# EAGLE design glove (EAGLE 7.6.0)

## Sheet 1 of 4
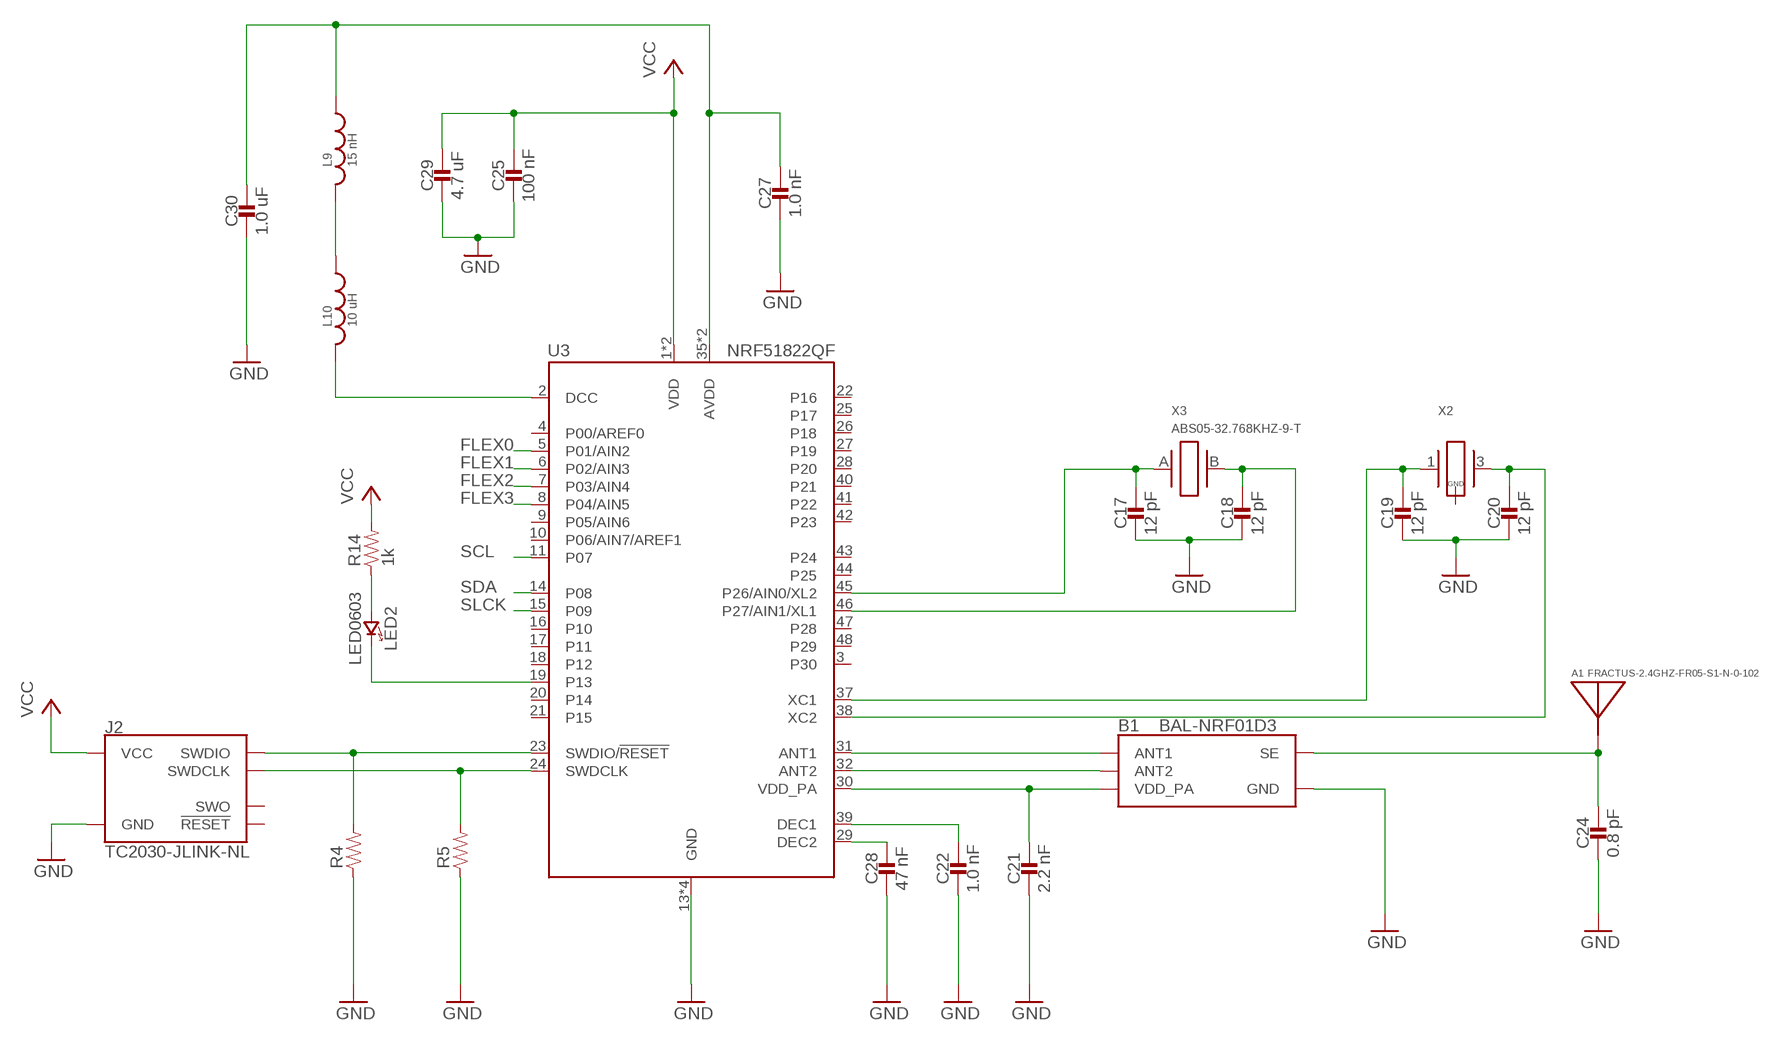
[diagram p0: schematic, sheet 1]

### Parts
A1  FRACTUS-2.4GHZ-FR05-S1-N-0-102  [FRACTUS-ANTENNA-FR05-S1-N-0-102]
B1  BAL-NRF01D3  [BAL-NRF01D3]
C17  12 pF  CAPACITOR0402_CAP  [0402_CAP]
C18  12 pF  CAPACITOR0402_CAP  [0402_CAP]
C19  12 pF  CAPACITOR0402_CAP  [0402_CAP]
C20  12 pF  CAPACITOR0402_CAP  [0402_CAP]
C21  2.2 nF  CAPACITOR0402_CAP  [0402_CAP]
C22  1.0 nF  CAPACITOR0402_CAP  [0402_CAP]
C24  0.8 pF  CAPACITOR0402_CAP  [0402_CAP]
C25  100 nF  CAPACITOR0402_CAP  [0402_CAP]
C27  1.0 nF  CAPACITOR0402_CAP  [0402_CAP]
C28  47 nF  CAPACITOR0402_CAP  [0402_CAP]
C29  4.7 uF  CAPACITOR0603_CAP  [0603_CAP]
C30  1.0 uF  CAPACITOR0603_CAP  [0603_CAP]
J2  TC2030-JLINK-NL  [TC2030-IDC-NL]
L9  15 nH  INDUCTOR0402  [0402_CAP]
L10  10 uH  INDUCTOR0603  [0603_CAP]
LED2  LED0603  [LED-0603]
R4  RESISTOR0603_RES  [0603-RES]
R5  RESISTOR0603_RES  [0603-RES]
R14  1k  RESISTOR0603_RES  [0603-RES]
U3  NRF51822QF  [QFN-48-6MM]
X2  TXC-8Y  [TXC-8Y]
X3  ABS05-32.768KHZ-9-T  [ABS05]

### Nets
FLEX0: U3.5(P01/AIN2)
FLEX1: U3.6(P02/AIN3)
FLEX2: U3.7(P03/AIN4)
FLEX3: U3.8(P04/AIN5)
GND: B1.GND C17.2 C18.2 C19.2 C20.2 C21.2 C22.2 C24.2 C25.2 C27.2 C28.2 C29.2 C30.2 J2.5(GND) R4.1 R5.1 U3.13(GND) U3.33(GND) U3.34(GND) U3.GND ; also sheet 2,3,4
N$6: LED2.C(CATHODE) U3.19(P13)
N$8: LED2.A(ANODE) R14.1
N$14: L10.2 U3.2(DCC)
N$15: L9.2 L10.1
N$16: C27.1 C30.1 L9.1 U3.35(AVDD) U3.36(AVDD)
N$19: J2.2(SWDIO) R4.2 U3.23(SWDIO/!RESET)
N$20: C20.1 U3.38(XC2) X2.3
N$21: B1.ANT1 U3.31(ANT1)
N$22: B1.ANT2 U3.32(ANT2)
N$23: B1.VCC(VDD_PA) C21.1 U3.30(VDD_PA)
N$24: A1.1(ANTENNA) B1.SE C24.1
N$25: C28.1 U3.29(DEC2)
N$26: C22.1 U3.39(DEC1)
N$27: C17.1 U3.45(P26/AIN0/XL2) X3.A
N$28: C18.1 U3.46(P27/AIN1/XL1) X3.B
N$29: C19.1 U3.37(XC1) X2.1
N$30: J2.4(SWDCLK) R5.2 U3.24(SWDCLK)
SCL: U3.11(P07) ; also sheet 2,3
SDA: U3.14(P08) ; also sheet 2,3
SLCK: U3.15(P09)
VCC: C25.1 C29.1 J2.1(VCC) R14.2 U3.1(VDD) U3.12(VDD) ; also sheet 3,4
Unconnected: J2.3(!RESET) J2.6(SWO) U3.3(P30) U3.4(P00/AREF0) U3.9(P05/AIN6) U3.10(P06/AIN7/AREF1) U3.16(P10) U3.17(P11) U3.18(P12) U3.20(P14) U3.21(P15) U3.22(P16) U3.25(P17) U3.26(P18) U3.27(P19) U3.28(P20) U3.40(P21) U3.41(P22) U3.42(P23) U3.43(P24) U3.44(P25) U3.47(P28) U3.48(P29) X2.2(GND) X2.4(GND)

## Sheet 2 of 4
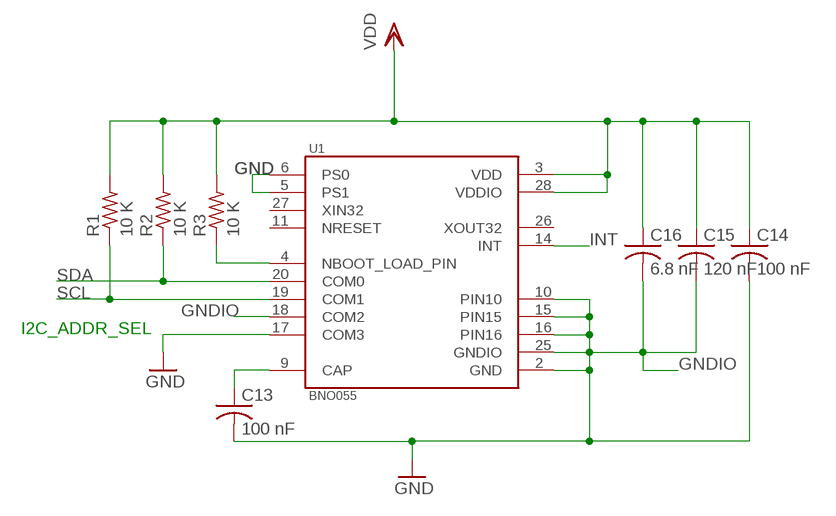
[diagram p1: schematic, sheet 2]

### Parts
C13  100 nF  C-USC0603  [C0603]
C14  100 nF  C-USC0603  [C0603]
C15  120 nF  C-USC0603  [C0603]
C16  6.8 nF  C-USC0603  [C0603]
R1  10 K  R-US_R0603  [R0603]
R2  10 K  R-US_R0603  [R0603]
R3  10 K  R-US_R0603  [R0603]
U1  BNO055  [LGA28R50P4X10_380X520X100]

### Nets
GND: U1.5(PS1) U1.6(PS0) U1.17(COM3) ; also sheet 1,3,4
GNDIO: C13.2 C14.2 C15.2 C16.2 U1.2(GND) U1.10(PIN10) U1.15(PIN15) U1.16(PIN16) U1.18(COM2) U1.25(GNDIO) ; supply symbol labelled GND
INT: U1.14(INT)
N$9: C13.1 U1.9(CAP)
N$18: R3.1 U1.4(NBOOT_LOAD_PIN)
SCL: R1.1 U1.19(COM1) ; also sheet 1,3
SDA: R2.1 U1.20(COM0) ; also sheet 1,3
VDD: C14.1 C15.1 C16.1 R1.2 R2.2 R3.2 U1.3(VDD) U1.28(VDDIO)
Unconnected: U1.11(NRESET) U1.26(XOUT32) U1.27(XIN32)

### Notes on the sheet
- I2C_ADDR_SEL

## Sheet 3 of 4
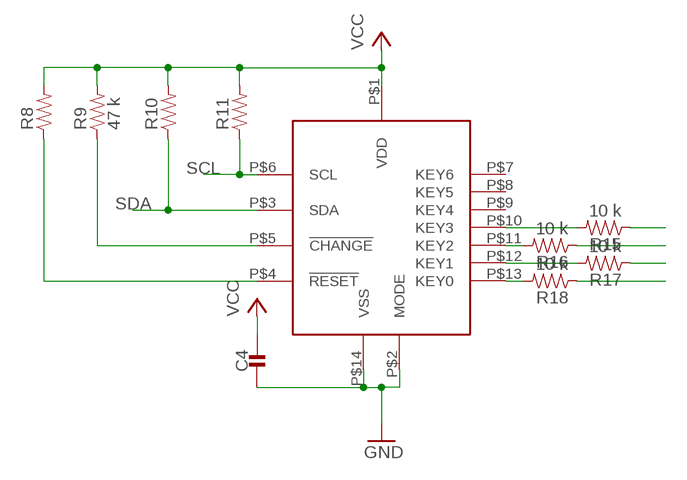
[diagram p2: schematic, sheet 3]

### Parts
C4  CAPACITOR0603_CAP  [0603_CAP]
R8  RESISTOR0603_RES  [0603-RES]
R9  47 k  RESISTOR0603_RES  [0603-RES]
R10  RESISTOR0603_RES  [0603-RES]
R11  RESISTOR0603_RES  [0603-RES]
R15  10 k  RESISTOR0603_RES  [0603-RES]
R16  10 k  RESISTOR0603_RES  [0603-RES]
R17  10 k  RESISTOR0603_RES  [0603-RES]
R18  10 k  RESISTOR0603_RES  [0603-RES]
U$1  COMMS  [QT1070]

### Nets
GND: C4.2 U$1.P$2(MODE) U$1.P$14(VSS) ; also sheet 1,2,4
N$17: R9.1 U$1.P$5(!CHANGE)
N$31: R15.2 U$1.P$10(KEY3)
N$32: R15.1
N$33: R16.2 U$1.P$11(KEY2)
N$34: R16.1
N$35: R17.2 U$1.P$12(KEY1)
N$36: R17.1
N$37: R18.2 U$1.P$13(KEY0)
N$39: R18.1
N$40: R8.1 U$1.P$4(!RESET)
SCL: R11.1 U$1.P$6(SCL) ; also sheet 1,2
SDA: R10.1 U$1.P$3(SDA) ; also sheet 1,2
VCC: C4.1 R8.2 R9.2 R10.2 R11.2 U$1.P$1(VDD) ; also sheet 1,4
Unconnected: U$1.P$7(KEY6) U$1.P$8(KEY5) U$1.P$9(KEY4)

## Sheet 4 of 4
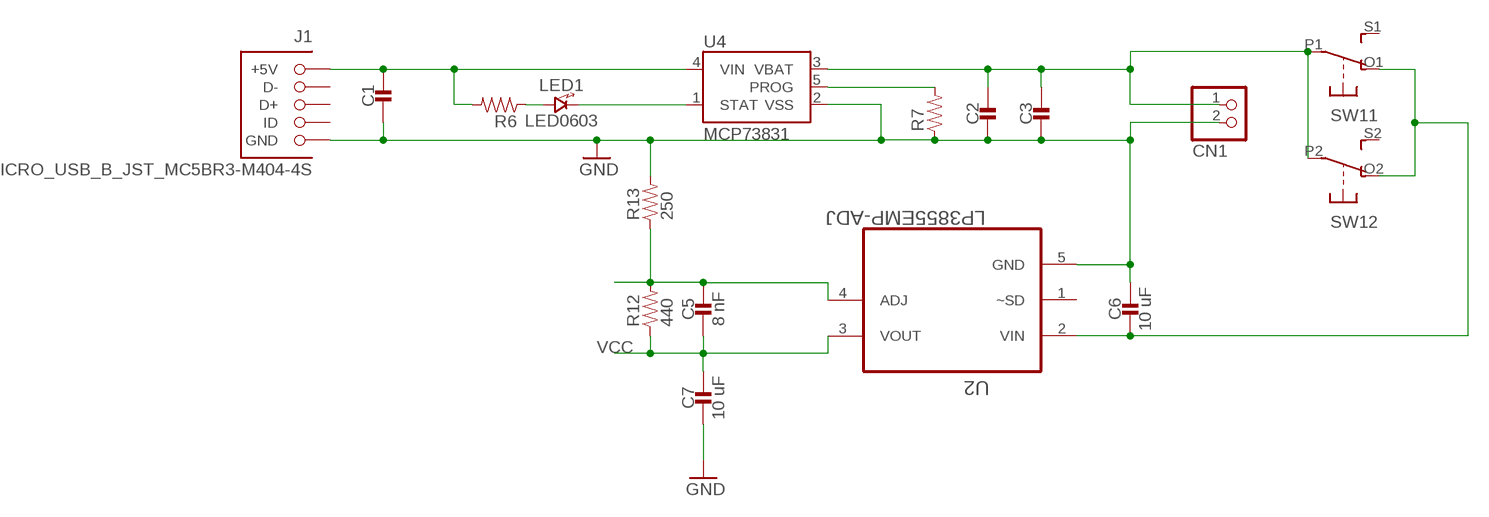
[diagram p3: schematic, sheet 4]

### Parts
C1  CAPACITOR0603_CAP  [0603_CAP]
C2  CAPACITOR0603_CAP  [0603_CAP]
C3  CAPACITOR0603_CAP  [0603_CAP]
C5  8 nF  CAPACITOR0603_CAP  [0603_CAP]
C6  10 uF  CAPACITOR0603_CAP  [0603_CAP]
C7  10 uF  CAPACITOR0603_CAP  [0603_CAP]
CN1  JST_2PIN-SMT-RA  [JST-PH-2-SMT-RA]
J1  MICRO_USB_B_JST_MC5BR3-M404-4S  [USB_MICRO_B-JST-MC5BR3-M404-4S-TB]
LED1  LED0603  [LED-0603]
R6  RESISTOR0603_RES  [0603-RES]
R7  RESISTOR0603_RES  [0603-RES]
R12  440  RESISTOR0603_RES  [0603-RES]
R13  250  RESISTOR0603_RES  [0603-RES]
SW1  DPDT-EG1390  [EG1390]
U2  LP3855EMP-ADJ  [SOT150P696X180-5N]
U4  MCP73831  [SOT23-5]

### Nets
GND: C1.2 C2.2 C3.2 C6.1 C7.2 CN1.2 J1.5(GND) R7.1 R13.2 U2.5(GND) U4.2(VSS) ; also sheet 1,2,3
N$1: C2.1 C3.1 CN1.1 SW1.P1(1:P) SW1.P2(2:P) U4.3(VBAT)
N$2: LED1.A(ANODE) R6.1
N$3: LED1.C(CATHODE) U4.1(STAT)
N$4: R7.2 U4.5(PROG)
N$5: C6.2 SW1.O1(1:O) SW1.O2(2:O) U2.2(VIN)
N$7: C5.1 R12.2 R13.1 U2.4(ADJ)
N$38: C1.1 J1.1(+5V) R6.2 U4.4(VIN)
VCC: C5.2 C7.1 R12.1 U2.3(VOUT) ; also sheet 1,3
Unconnected: J1.2(D-) J1.3(D+) J1.4(ID) SW1.S1(1:S) SW1.S2(2:S) U2.1(~SD)

## Library data of the parts
A1 = chips:FRACTUS-2.4GHZ-FR05-S1-N-0-102: Fractus Compact Reach XtendTM chip antenna is engineered specifically for Bluetooth, WLAN 802.11 b/g/n and other wireless devices operating at the ISM 2.4 GHz band. Compact Reach Xtend combines small form factor size and high performance to improve the functionality of your wireless devices.; RICHARDSON_RFPD: FR05-S1-N-0102B
B1 = chips:BAL-NRF01D3: 50 ohm nominal input / conjugate match balun to nRF51422-QFAA, nRF24LE1, nRF51822-QFAA/AB, with integrated harmonic filter; DIGIKEY: 497-13637-1-ND; MOUSER: 511-BAL-NRF01D3
C1-C7 C17-C22 C24 C25 C27-C30 = passives:CAPACITOR: 0402 Capacitor
C13-C16 = rcl:C-US: CAPACITOR, American symbol
CN1 = adafruit:JST_2PIN: JST 2-Pin Connectors of various flavors SMT-RA (S2B-PH-SM4) 4UConnector #17311 SMT (B2B-PH-SM4) THM-RA (S2B-PH) THM (B2B-PH)
J1 = connector:MICRO_USB_B_JST_MC5BR3-M404-4S: Micro USB B mid mount; DIGIKEY: 455-2567-2-ND; MOUSER: 53X3655
J2 = connector:TC2030-JLINK
L9 L10 = passives:INDUCTOR: A very specific inductor
LED1 LED2 = leds:LED: LED
R1-R3 = rcl:R-US_: RESISTOR, American symbol
R4-R18 = passives:RESISTOR: Resistor Basic schematic elements and footprints for 0603, 1206, and PTH resistors.
SW1 = adafruit:DPDT
U1 = BNO055:BNO055: BNO055 9-axis Absolute Orientation Sensor ( SiP ) w/Sensors and Sensor Fusion; AVAILABILITY: Good; DESCRIPTION: BNO055 9-axis Absolute Orientation Sensor ( SiP ) w/Sensors and Sensor Fusion; MF: Bosch; MP: BNO055; PACKAGE: LGA-28 Bosch; PRICE: 9.48 USD
U2 = LP3855EMP-ADJ:LP3855EMP-ADJ: Linear Regulators; AVAILABILITY: Good; DESCRIPTION: 1.5A Fast Response Ultra Low Dropout Linear Regulators 5-SOT-223 -40 to 125; MF: Texas Instruments; MP: LP3855EMP-ADJ; PACKAGE: SOT-223 Texas Instruments; PRICE: 3.03 USD
U3 = chips:NRF51822: Multiprotocol Bluetooth® 4.0 low energy/2.4 GHz RF SoC; DIGIKEY: 1490-1032-1-ND; MOUSER: 949-NRF51822-QFAB-R7
U4 = SparkFun-PowerIC:MCP73831: Miniature single cell, fully integrated Li-Ion, Li-polymer charge management controller http://ww1.microchip.com/downloads/en/DeviceDoc/21984a.pdf
U$1 = QT1070:COMMS
X2 = crystals:TXC-8Y: 2mmx1.6mm SMD Crystal
X3 = crystals:ABS05-32.768KHZ: 32.768kHz Crystal; DIGIKEY: 535-11897-1-ND

## Board
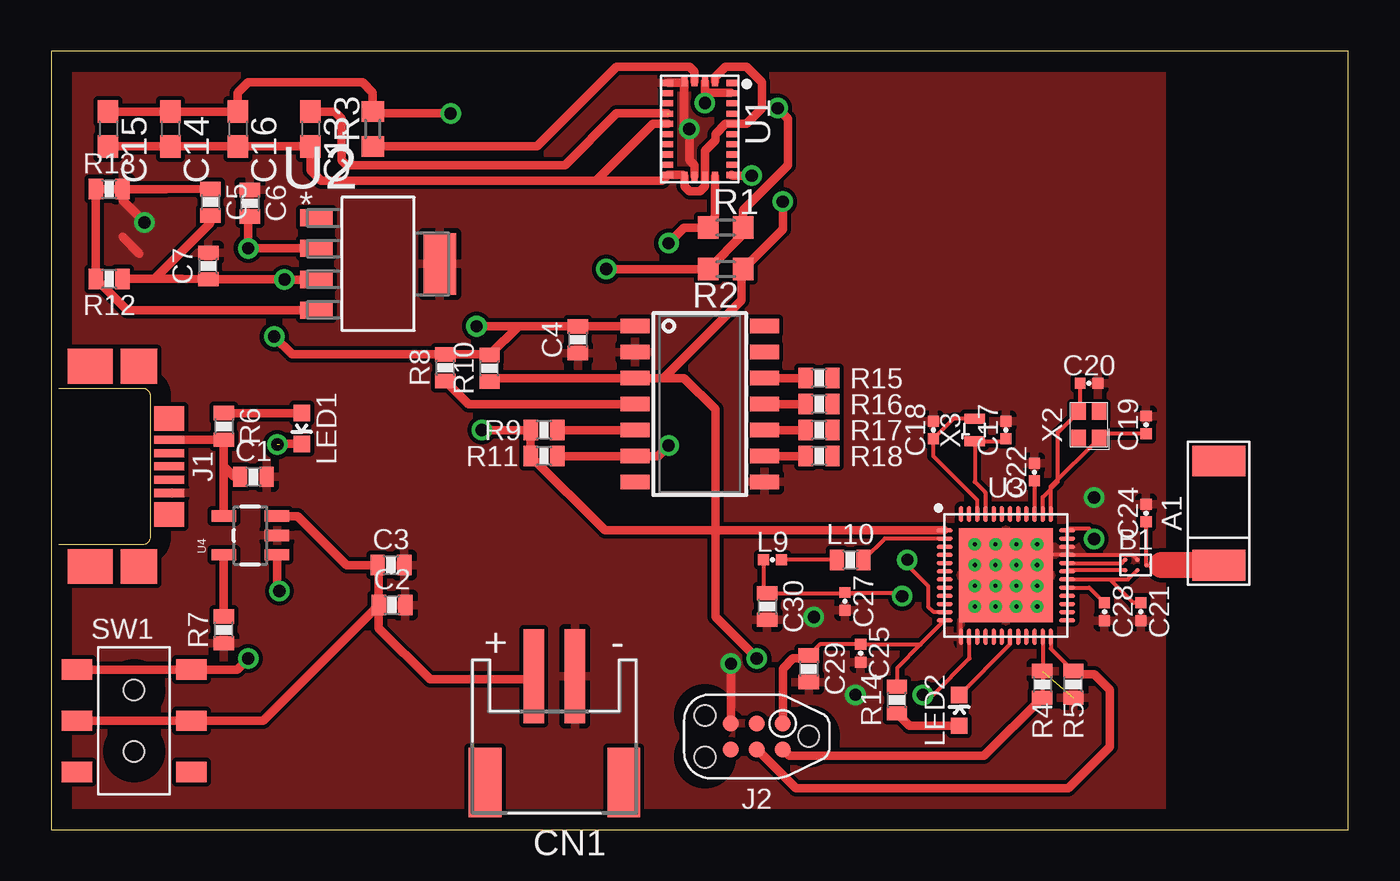
[diagram p4: board, top side]
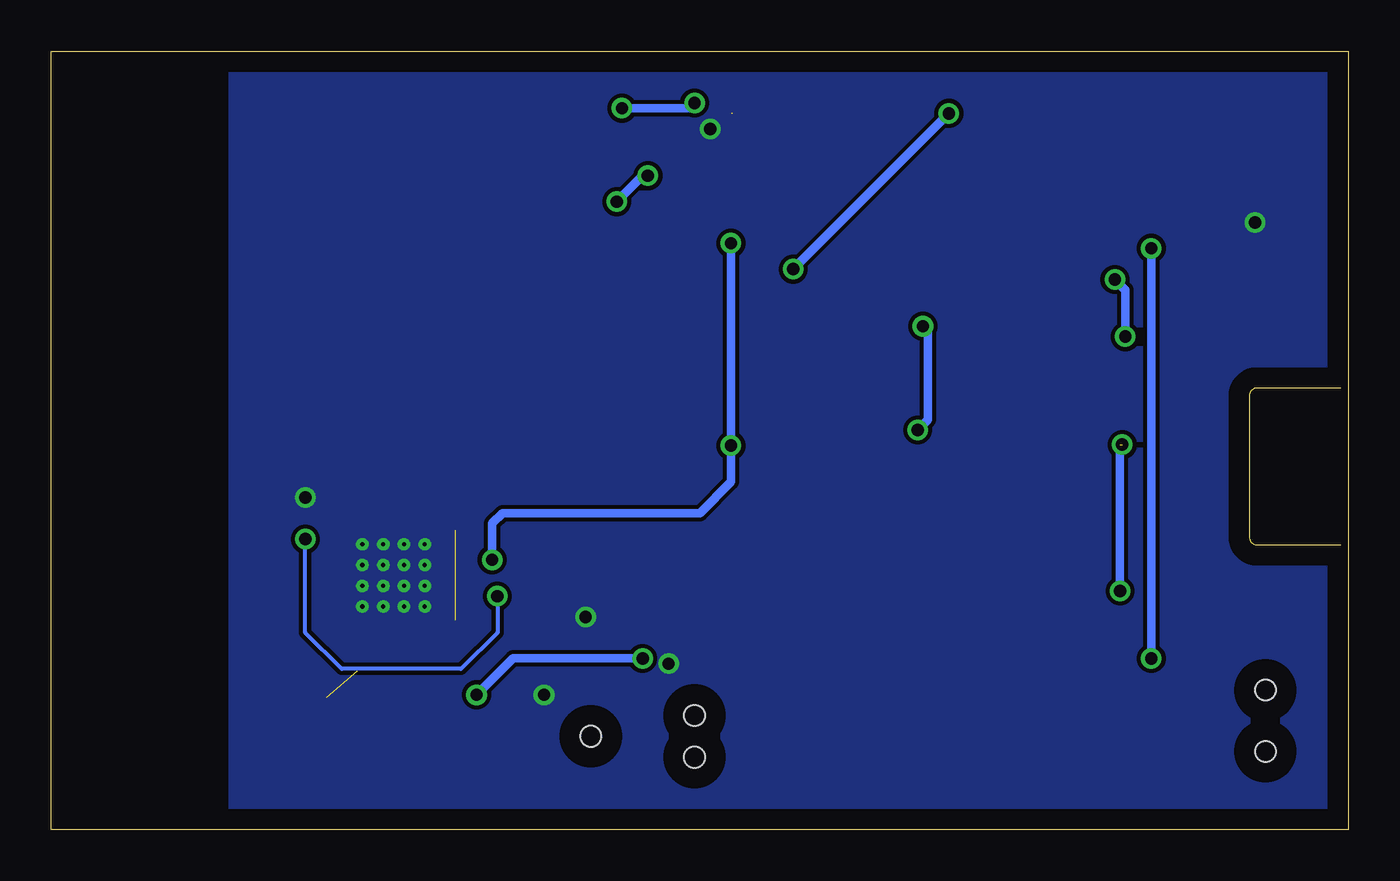
[diagram p5: board, bottom side, seen from below]

Size 63.5 x 38.1 mm. Coordinates in mm from the lower left corner, seen from the top.
Outline: 0,0 63.5,0 63.5,38.1 0,38.1 0,0
Copper layers (1*16): Top 0.035mm / dielectric 1.5mm / Bottom 0.035mm
Design rules "default": minimum track width 10mil, minimum drill 24mil, track to track 8mil, track to pad 8mil, pad to pad 8mil, via to via 8mil, smd to smd 8mil, copper to edge 40mil, drill to drill 8mil, minimum pad ring 10mil, minimum via ring 8mil, stop-mask expansion 4mil, vias tented up to drill 0mil, thermal gap 10mil

### Footprints (pad centres in the part's own frame; a part is rotated, then mirrored left to right if it is on the bottom)
FRACTUS-ANTENNA-FR05-S1-N-0-102 = smd 1.5 x 2.6: 1 -2.55,0; 2 2.55,0
BAL-NRF01D3 = smd 0.22 x 0.22: ANT1 -0.517,-0.25; ANT2 -0.517,0.25; GND 0.083,0.25; SE 0.516,0; VCC 0.083,-0.25
0603_CAP = smd 0.7 x 1: 1 -0.65,0; 2 0.65,0
C0603 = smd 1.1 x 1: 1 -0.85,0; 2 0.85,0
0402_CAP = smd 0.536 x 0.546: 1 -0.433,0; 2 0.433,0
JST-PH-2-SMT-RA = smd 1 x 4.6: 1 1,-3.7; 2 -1,-3.7 | smd 1.6 x 3.4: NC1 -3.4,1.5; NC2 3.4,1.5
USB_MICRO_B-JST-MC5BR3-M404-4S-TB = smd 0.4 x 1.45: 1 -1.3,3.875; 2 -0.65,3.875; 3 0,3.875; 4 0.65,3.875; 5 1.3,3.875 | smd 1.7 x 2.2: P$1 -4.9,0; P$2 4.9,0 | smd 1.7 x 1.8: P$3 -4.9,2.4; P$4 4.9,2.4 | smd 1.2 x 1.45: P$5 -2.35,3.875; P$6 2.35,3.875
TC2030-IDC-NL = smd 0.787 x 0.787: 1 -1.27,-0.635; 2 -1.27,0.635; 3 0,-0.635; 4 0,0.635; 5 1.27,-0.635; 6 1.27,0.635 | hole 1.016: -2.54,0; 2.54,1.016; 2.54,-1.016
LED-0603 = smd 0.8 x 0.8: A 0,-0.75; C 0,0.75
R0603 = smd 1 x 1.1: 1 -0.85,0; 2 0.85,0
0603-RES = smd 0.7 x 1: 1 -0.65,0; 2 0.65,0
EG1390 = smd 1 x 1.5: O1 -2.5,2.8; O2 -2.5,-2.8; P1 0,2.8; P2 0,-2.8; S1 2.5,2.8; S2 2.5,-2.8 | hole 1: 1.5,0; -1.5,0
LGA28R50P4X10_380X520X100 = smd 0.3 x 0.525: 1 -2.25,1.562; 6 -2.25,-1.562; 7 -1.75,-1.562; 8 -1.25,-1.562; 9 -0.75,-1.562; 10 -0.25,-1.562; 11 0.25,-1.562; 12 0.75,-1.562; 13 1.25,-1.562; 14 1.75,-1.562; 15 2.25,-1.562; 20 2.25,1.562; 21 1.75,1.562; 22 1.25,1.562; 23 0.75,1.562; 24 0.25,1.562; 25 -0.25,1.562; 26 -0.75,1.562; 27 -1.25,1.562; 28 -1.75,1.562 | smd 0.425 x 0.3: 2 -2.312,0.75; 3 -2.312,0.25; 4 -2.312,-0.25; 5 -2.312,-0.75; 16 2.312,-0.75; 17 2.312,-0.25; 18 2.312,0.25; 19 2.312,0.75
SOT150P696X180-5N = smd 1.6 x 0.838: 1 -3.023,2.261; 2 -3.023,0.762; 3 -3.023,-0.762; 4 -3.023,-2.261 | smd 1.6 x 2.997: 5 3.023,0
QFN-48-6MM = smd 0.8 x 0.203: 1 -3,2.2; 2 -3,1.8; 3 -3,1.4; 4 -3,1; 5 -3,0.6; 6 -3,0.2; 7 -3,-0.2; 8 -3,-0.6; 9 -3,-1; 10 -3,-1.4; 11 -3,-1.8; 12 -3,-2.2; 25 3,-2.2; 26 3,-1.8; 27 3,-1.4; 28 3,-1; 29 3,-0.6; 30 3,-0.2; 31 3,0.2; 32 3,0.6; 33 3,1; 34 3,1.4; 35 3,1.8; 36 3,2.2 | smd 0.203 x 0.8: 13 -2.2,-3; 14 -1.8,-3; 15 -1.4,-3; 16 -1,-3; 17 -0.6,-3; 18 -0.2,-3; 19 0.2,-3; 20 0.6,-3; 21 1,-3; 22 1.4,-3; 23 1.8,-3; 24 2.2,-3; 37 2.2,3; 38 1.8,3; 39 1.4,3; 40 1,3; 41 0.6,3; 42 0.2,3; 43 -0.2,3; 44 -0.6,3; 45 -1,3; 46 -1.4,3; 47 -1.8,3; 48 -2.2,3 | smd 4.6 x 4.6: GND 0,0
SOT23-5 = smd 0.55 x 1.2: 1 -0.95,-1.3; 2 0,-1.3; 3 0.95,-1.3; 4 0.95,1.3; 5 -0.95,1.3
QT1070 = smd 1.422 x 0.711: P$1 -3.175,3.81; P$2 -3.175,2.54; P$3 -3.175,1.27; P$4 -3.175,0; P$5 -3.175,-1.27; P$6 -3.175,-2.54; P$7 -3.175,-3.81; P$8 3.175,3.81; P$9 3.175,2.54; P$10 3.175,1.27; P$11 3.175,0; P$12 3.175,-1.27; P$13 3.175,-2.54; P$14 3.175,-3.81
TXC-8Y = smd 0.8 x 0.7: 1 -0.65,-0.5; 2 0.65,-0.5; 3 0.65,0.5; 4 -0.65,0.5
ABS05 = smd 0.5 x 1: A -0.55,0; B 0.55,0

### Placement (x,y rotation side)
A1  57.15,15.49 90 top
B1  53.09,12.95 0 top
C1  9.91,17.27 0 top
C2  16.69,11 0 top
C3  16.64,12.95 0 top
C4  25.78,23.98 270 top
C5  7.8,30.71 270 top
C6  9.73,30.66 270 top
C7  7.7,27.58 90 top
C13  12.7,34.29 270 top
C14  5.84,34.29 270 top
C15  2.79,34.29 270 top
C16  9.14,34.29 270 top
C17  46.74,19.56 90 top
C18  43.18,19.56 90 top
C19  53.59,19.81 90 top
C20  50.8,21.84 0 top
C21  53.34,10.67 270 top
C22  48.13,17.5 90 top
C24  53.59,15.49 90 top
C25  39.62,8.64 270 top
C27  38.86,11.18 270 top
C28  51.56,10.67 270 top
C29  37.08,7.87 270 top
C30  35.05,10.92 270 top
CN1  24.64,3.81 180 top
J1  1.91,17.78 270 top
J2  34.54,4.57 180 top
L9  35.31,13.21 0 top
L10  39.12,13.21 0 top
LED1  12.27,19.63 180 top
LED2  44.45,5.84 0 top
R1  33.02,29.46 0 top
R2  33.02,27.43 180 top
R3  15.75,34.29 90 top
R4  48.51,7.11 270 top
R5  50.04,7.11 90 top
R6  8.46,19.74 270 top
R7  8.46,9.78 90 top
R8  19.3,22.61 90 top
R9  24.13,19.56 180 top
R10  21.46,22.58 90 top
R11  24.13,18.29 180 top
R12  2.84,26.95 180 top
R13  2.84,31.34 0 top
R14  41.4,6.35 90 top
R15  37.59,22.1 180 top
R16  37.59,20.83 180 top
R17  37.59,19.56 180 top
R18  37.59,18.29 180 top
SW1  4.06,5.33 270 top
U1  31.75,34.29 270 top
U2  16,27.69 0 top
U3  46.74,12.45 0 top
U4  9.75,14.4 90 top
U$1  31.75,20.83 0 top
X2  50.8,19.81 90 top
X3  45.21,19.56 90 top

### Tracks (layer width: path | path; a pad name or v marks a point on that pad's centre or on a via)
GND  (via drill 0.2, 0.6)  (1 unrouted)
  Top 0.203: U3.34 U3.33 | U3.33 47.74,13.45 | U3.33 52.93,13.45 B1.GND | v46.23,12.95 U3.GND v46.23,11.94 v47.24,11.94 v47.24,12.95 v46.23,12.95 | v45.21,13.97 v46.23,13.97 v47.24,13.97 v48.26,13.97 v48.26,12.95 v48.26,11.94 v48.26,10.92 v47.24,10.92 v46.23,10.92 v45.21,10.92 | v45.21,10.92 v45.21,11.94 v45.21,12.95 v46.23,12.95 | U3.13 44.54,10.25 v45.21,10.92
  Top 0.406: 3.5,29.02 4.32,28.19 | 7.66,28.19 C7.2 | 18.8,27.91 U2.5 | U1.6 30.94,36.54 U1.5 31,36.33 30.99,36.32 30.99,34.54 v31.24,34.29 31.24,32.77 31.5,32.51 U1.17 | 47.74,13.45 v47.24,12.95 U3.GND | R13.2 3.5,30.8 v4.57,29.72 | J2.5 v33.27,8.13
  other vias: 51.05,16.26 39.37,6.6 37.34,10.41
  pour Top: 0,38.1 0,0 54.36,0 54.36,38.1
  pour Bottom: 0,38.1 54.61,38.1 54.61,0 54.86,-0.25 0,-0.25
GNDIO
  Top 0.203: U1.18 | 30.94,32.04 U1.16
  Top 0.406: C15.2 C14.2 C16.2 C13.2 12.7,32.26 13.21,31.75 26.67,31.75 | 26.67,31.75 29.9,31.75 U1.15 30.94,32.04 | U1.16 31,31.48 31.24,31.24 31.75,31.24 32,31.5 U1.18 | U1.10 29.46,34.54 26.67,31.75 | U1.18 32,33.23 32.51,33.74 32.51,34.04 33.02,34.54 U1.25 34.04,34.54 34.8,35.31 34.8,36.58 34.04,37.34 33.02,37.34 32.5,36.82 U1.2
N$1
  Top 0.406: U4.3 12.08,15.35 14.48,12.95 C3.1 16.04,12.9 C2.1 | SW1.P2 SW1.P1 10.37,5.33 C2.1 | C2.1 16.04,9.87 18.54,7.37 23.49,7.37 CN1.1
N$2
  Top 0.406: R6.1 LED1.A
N$3  (via drill 0.6)  (1 unrouted)
  Top 0.406: 10.92,13.45 U4.1 11.05,11.68 v11.18,11.68 | LED1.C 11.07,18.88 v11.07,18.85
  Bottom 0.406: 11.18,18.85 v11.18,11.68
N$4
  Top 0.406: U4.5 R7.2
N$5  (via drill 0.6)
  Top 0.406: U2.2 v9.65,28.45 9.65,30.19 C6.2 | SW1.O2 SW1.O1 9.1,7.83 v9.65,8.38
  Bottom 0.406: v9.65,8.38 v9.65,28.45
N$6
  Top 0.203: LED2.C 46.94,9.08 U3.19
N$7
  Top 0.406: R12.2 R13.1 5.62,31.34 C5.1 | 2.18,28.19 R12.2 | U2.4 3.72,25.43 R12.2
N$8
  Top 0.406: R14.1 42.01,5.09 LED2.A
N$9  (1 unrouted)
  Top 0.406: C13.1 13.88,35.14 14.22,34.8 14.22,32.77 14.48,32.51 25.15,32.51 27.69,35.05 30.18,35.05
N$14
  Top 0.203: U3.2 40.8,14.25 L10.2
N$15
  Top 0.203: L10.1 L9.2
N$16  (via drill 0.6)
  Top 0.203: U3.35 U3.36 49.82,14.73 50.8,14.73 51.05,14.48 v51.05,14.22 | L9.1 34.87,11.65 C30.1 39.59,11.57 C27.1 41.48,11.61 v41.66,11.43
  Bottom 0.203: v41.66,11.43 41.66,9.65 43.43,7.87 49.28,7.87 51.05,9.65 v51.05,14.22
N$17
  Top 0.406: R9.1 U$1.P$5
N$18
  Top 0.406: R3.1 23.79,33.44 27.69,37.34 31.24,37.34 31.5,37.08 U1.4
N$19
  Top 0.203: U3.23 48.54,7.96 R4.2
  Top 0.406: R4.2 45.66,3.61 36.14,3.61 J2.2
N$20
  Top 0.203: U3.38 48.54,16.28 49.28,17.02 49.28,19.44 X2.3 50.37,20.53 C20.1
N$21
  Top 0.203: B1.ANT1 49.79,12.7 U3.31
N$22
  Top 0.203: U3.32 52.41,13.05 B1.ANT2
N$23
  Top 0.203: U3.30 51.82,12.25 | 51.82,12.25 52.71,12.25 B1.VCC | C21.1 52.96,11.1 51.82,12.25
N$24
  Top 0.203: C24.1 53.6,15.05 B1.SE 54.36,12.95
  Top 1.27: A1.1 54.62,12.94 54.61,12.95 54.36,12.95
N$25
  Top 0.203: U3.29 50.82,11.85 C28.1
N$26
  Top 0.203: C22.1 U3.39
N$27
  Top 0.203: U3.45 45.72,15.46 45.72,16.51 45.21,17.02 X3.A 46.62,19.01 C17.1
N$28
  Top 0.203: U3.46 45.34,16.13 43.18,18.29 C18.1 44.16,20.11 X3.B
N$29
  Top 0.203: C19.1 51.52,19.38 X2.1 48.94,16.8 U3.37
N$30
  Top 0.203: U3.24 48.94,8.86 R5.2
  Top 0.406: R5.2 50.18,7.62 51.05,7.62 51.82,6.86 51.82,4.06 49.78,2.03 36.45,2.03 J2.4
N$31
  Top 0.406: U$1.P$10 R15.2
N$33
  Top 0.406: R16.2 U$1.P$11
N$35
  Top 0.406: U$1.P$12 R17.2
N$37
  Top 0.406: R18.2 U$1.P$13
N$38
  Top 0.406: J1.1 R6.2 8.45,17.78 | 8.45,17.78 U4.4 | C1.1 8.96,17.27 8.45,17.78
N$40
  Top 0.406: U$1.P$4 20.43,20.83 R8.1
SCL  (via drill 0.6)
  Top 0.203: 41.91,12.95 42.93,11.94 42.93,10.92 43.18,10.67 43.71,10.67 U3.11
  Top 0.406: U1.19 32.5,30.05 R1.1 | R1.1 32.17,29.38 32,29.21 | R11.1 U$1.P$6 29.72,18.29 v30.23,18.8 | v30.23,28.7 30.99,29.46 R1.1 | v41.91,13.21 41.91,12.95
  Bottom 0.406: v30.23,28.7 v30.23,18.8 30.23,17.02 31.75,15.49 41.4,15.49 41.91,14.99 v41.91,13.21
SDA  (via drill 0.6)
  Top 0.203: v42.67,6.6 43.18,6.6 44.96,8.38 44.96,9.42 U3.14
  Top 0.406: U1.20 33.35,32 v34.29,32 | v35.81,30.73 35.81,29.38 R2.1 33.78,27.34 33.78,25.91 29.97,22.1 | 29.97,22.1 U$1.P$3 21.63,22.1 R10.1 | 29.97,22.1 30.99,22.1 32.51,20.57 32.51,10.41 v34.54,8.38
  Bottom 0.406: v34.29,32 34.54,32 v35.81,30.73 | v34.54,8.38 40.89,8.38 v42.67,6.6
VCC  (via drill 0.6)  (1 unrouted)
  Top 0.203: 42.56,9.07 C25.1 37.63,9.07 C29.1 | 42.56,9.07 U3.12 | 42.56,9.07 41.4,7.91 R14.2
  Top 0.406: 12.98,26.93 U2.3 v11.43,26.92 11.42,26.93 C7.1 6.43,26.95 5.08,26.95 | R12.1 5.08,26.95 | v10.92,24.13 11.8,23.26 R8.2 21.44,23.26 R10.2 22.87,24.64 | U$1.P$1 25.79,24.64 | 25.79,24.64 C4.1 | 25.79,24.64 22.87,24.64 | v21.08,19.56 R9.2 R11.2 27.12,14.65 U3.1 | v20.83,24.64 22.87,24.64 | C5.2 7.8,29.67 5.08,26.95 | J2.1 35.81,7.87 36.32,8.38 36.94,8.38 C29.1
  Bottom 0.406: v10.92,24.13 10.92,26.43 10.93,26.43 v11.43,26.92 | v21.08,19.56 20.57,20.07 20.57,24.38 v20.83,24.64
VDD  (via drill 0.6)
  Top 0.203: 33.28,36.07 U1.28 | v32,35.56
  Top 0.406: C15.1 C14.1 C16.1 9.14,36.07 9.65,36.58 15.24,36.58 15.75,36.07 R3.2 15.84,35.05 v19.56,35.05 | v27.18,27.43 R2.2 33.87,29.13 R1.2 33.87,30.31 36.07,32.51 36.07,34.8 v35.56,35.31 | U1.3 32,36.07 | 32,36.07 v32,35.56 | 33.28,36.07 32,36.07
  Bottom 0.406: v27.18,27.43 v19.56,35.05 | v32,35.56 32.26,35.31 v35.56,35.31